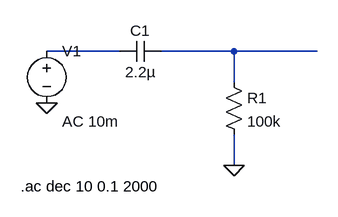
[diagram p0: schematic Frequency_response.asc]
Frequency_response.asc, the LTspice schematic file:
Version 4.1
SHEET 1 880 680
WIRE 0 80 -112 80
WIRE 176 80 64 80
WIRE 304 80 176 80
WIRE 176 128 176 80
WIRE 176 256 176 208
FLAG 176 256 0
FLAG -112 160 0
SYMBOL res 160 112 R0
SYMATTR InstName R1
SYMATTR Value 100k
SYMBOL cap 64 64 R90
WINDOW 0 0 32 VBottom 2
WINDOW 3 32 32 VTop 2
SYMATTR InstName C1
SYMATTR Value 2.2µ
SYMBOL voltage -112 64 R0
WINDOW 123 24 124 Left 2
WINDOW 39 0 0 Left 0
SYMATTR InstName V1
SYMATTR Value ""
SYMATTR Value2 AC 10m
TEXT -152 288 Left 2 !.ac dec 10 0.1 2000

The netlist it stands for:
* Frequency_response.asc
R1 N002 0 100k
C1 N002 N001 2.2µ
V1 N001 0 AC 10m
.ac dec 10 0.1 2000
.backanno
.end